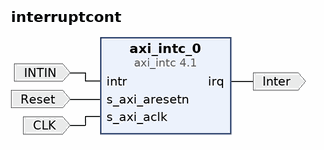
[diagram p0: block diagram of the top level]
# Vivado block design interruptcont, xc7a100tcsg324-1, Vivado 2017.4
create_bd_design interruptcont

create_bd_port -dir O -type data Inter
create_bd_port -dir I INTIN
create_bd_port -dir I Reset
create_bd_port -dir I -type clk CLK
set_property -dict {CONFIG.FREQ_HZ 100000000} [get_bd_ports CLK]

create_bd_cell -type ip -vlnv xilinx.com:ip:axi_intc:4.1 axi_intc_0
set_property -dict [list \
  CONFIG.C_HAS_IPR 1 \
  CONFIG.C_HAS_SIE 1 \
  CONFIG.C_HAS_CIE 1 \
  CONFIG.C_HAS_IVR 1 \
  CONFIG.C_IRQ_IS_LEVEL 0 \
] [get_bd_cells axi_intc_0]

# ---- connections ----

connect_bd_net [get_bd_pins axi_intc_0/irq] [get_bd_ports Inter]
connect_bd_net [get_bd_ports INTIN] [get_bd_pins axi_intc_0/intr]
connect_bd_net [get_bd_ports Reset] [get_bd_pins axi_intc_0/s_axi_aresetn]
connect_bd_net [get_bd_ports CLK] [get_bd_pins axi_intc_0/s_axi_aclk]

validate_bd_design
save_bd_design
